# EAGLE design marshall (EAGLE 7.1.0)
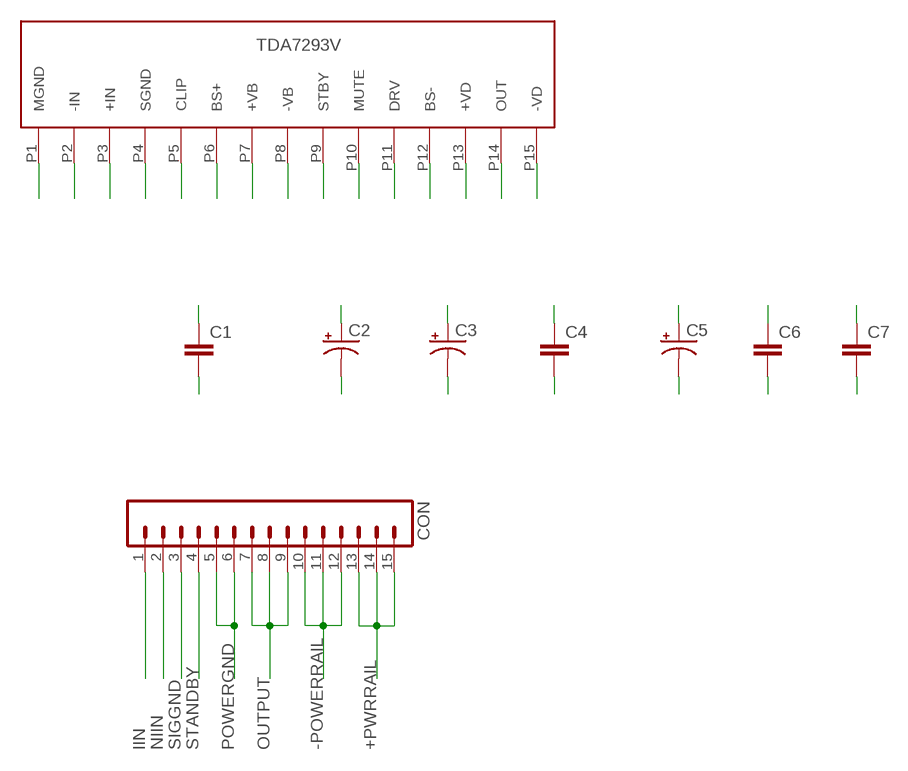
[diagram p0: schematic, sheet 1]

## Parts
C1  CAPPTH1  [CAP-PTH-5MM]
C2  CAP_POLPTH2  [CPOL-RADIAL-10UF-25V]
C3  CAP_POLPTH2  [CPOL-RADIAL-10UF-25V]
C4  CAPPTH1  [CAP-PTH-5MM]
C5  CAP_POLPTH2  [CPOL-RADIAL-10UF-25V]
C6  CAPPTH1  [CAP-PTH-5MM]
C7  CAPPTH1  [CAP-PTH-5MM]
CON  M15  [1X15]
U$1  TDA7293V  [TDA7293V]

## Nets
+PWRRAIL: C1.1 C2.1(+) CON.13 CON.14 CON.15 U$1.P7(+VB) U$1.P10(MUTE) U$1.P13(+VD)
-POWERRAIL: C3.2(-) C4.1 CON.10 CON.11 CON.12 U$1.P8(-VB) U$1.P15(-VD)
C5+: C5.1(+) U$1.P12(BS-)
C5-: C5.2(-) U$1.P6(BS+)
IIN: C6.2 C7.2 CON.1
N$17: U$1.P2(-IN)
N$20: U$1.P5(CLIP)
N$26: U$1.P11(DRV)
NIIN: C6.1 CON.2 U$1.P3(+IN)
OUTPUT: CON.7 CON.8 CON.9 U$1.P14(OUT)
POWERGND: C1.2 C2.2(-) C3.1(+) C4.2 CON.5 CON.6 U$1.P1(MGND)
SIGGND: C7.1 CON.3 U$1.P4(SGND)
STANDBY: CON.4 U$1.P9(STBY)

## Library data of the parts
C1 C4 C6 C7 = SparkFun-Capacitors:CAP: Capacitor Standard 0603 ceramic capacitor, and 0.1" leaded capacitor.
C2 C3 C5 = SparkFun-Capacitors:CAP_POL: Capacitor Polarized These are standard SMD and PTH capacitors. Normally 10uF, 47uF, and 100uF in electrolytic and tantalum varieties. Always verify the external diameter of the through hole cap, it varies with capacity, voltage, and manufacturer. The EIA devices should be standard.
CON = SparkFun-Connectors:M15: Header 15 Standard 15-pin 0.1" header. Use with straight break away headers (SKU : PRT-00116), right angle break away headers (PRT-00553), swiss pins (PRT-00743), machine pins (PRT-00117), and female headers (PRT-00115).
U$1 = TDA7293V:TDA7293V

## Board
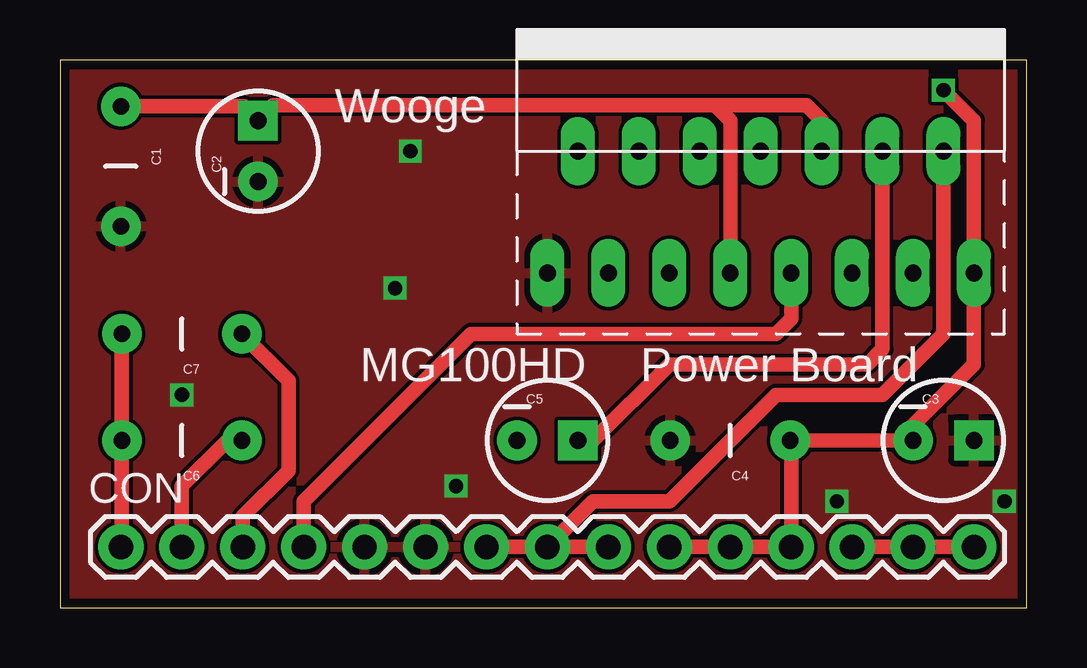
[diagram p1: board, top side]
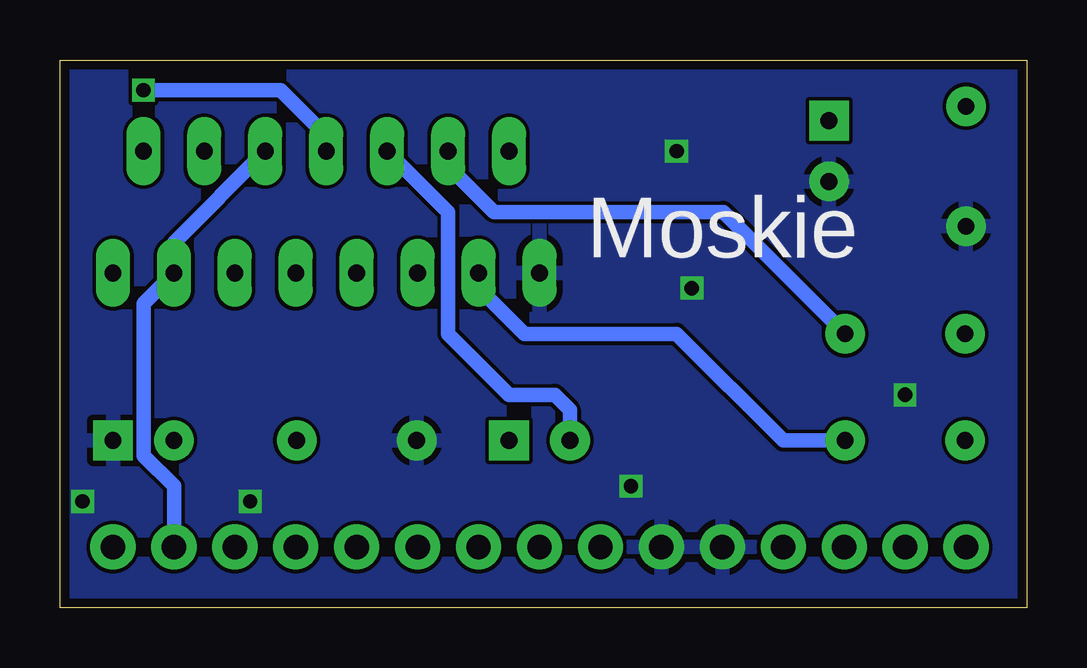
[diagram p2: board, bottom side, seen from below]

Size 40.31 x 22.85 mm. Coordinates in mm from the lower left corner, seen from the top.
Outline: 0,0 40.31,0 40.31,22.85 0,22.85 0,0
Copper layers (1*16): Top 0.0356mm / dielectric 1.5011mm / Bottom 0.0356mm
Design rules "LaenPCBOrder": minimum track width 6mil, minimum drill 13mil, track to track 6mil, track to pad 6mil, pad to pad 6mil, via to via 6mil, smd to smd 6mil, copper to edge 15mil, drill to drill 6mil, minimum pad ring 7mil, minimum via ring 7mil, stop-mask expansion 3mil, vias tented up to drill 0mil, thermal gap 10mil

### Footprints (pad centres in the part's own frame; a part is rotated, then mirrored left to right if it is on the bottom)
CAP-PTH-5MM = drill 0.7 pad 1.651: 1 -2.5,0; 2 2.5,0
CPOL-RADIAL-10UF-25V = drill 0.7 pad 1.651 square: 1 1.27,0 | drill 0.7 pad 1.651: 2 -1.27,0
1X15 = drill 1.016 pad 1.88: 1 0,0; 2 2.54,0; 3 5.08,0; 4 7.62,0; 5 10.16,0; 6 12.7,0; 7 15.24,0; 8 17.78,0; 9 20.32,0; 10 22.86,0; 11 25.4,0; 12 27.94,0; 13 30.48,0; 14 33.02,0; 15 35.56,0
TDA7293V = drill 0.7 pad 1.422 long: P1 1.27,-5.08; P2 2.54,0; P3 3.81,-5.08; P4 5.08,0; P5 6.35,-5.08; P6 7.62,0; P7 8.89,-5.08; P8 10.16,0; P9 11.43,-5.08; P10 12.7,0; P11 13.97,-5.08; P12 15.24,0; P13 16.51,-5.08; P14 17.78,0; P15 19.05,-5.08

### Placement (x,y rotation side)
C1  2.54,18.41 270 top
C2  8.26,19.05 90 top
C3  36.83,6.99 0 top
C4  27.94,6.99 180 top
C5  20.32,6.99 0 top
C6  5.08,6.99 180 top
C7  5.08,11.43 180 top
CON  2.54,2.54 0 top
U$1  19.05,19.05 0 top

### Tracks (layer width: path | path; a pad name or v marks a point on that pad's centre or on a via)
+PWRRAIL
  Top 0.61: C1.1 7.66,20.91 C2.1 8.89,20.95 27.3,20.95 | U$1.P7 27.94,20.32 27.3,20.95 | U$1.P10 31.75,20.32 31.11,20.95 27.3,20.95 | CON.13 CON.14 CON.15
  Bottom 0.61: U$1.P10 35.56,15.24 U$1.P13 36.83,12.7 36.83,6.35 35.56,5.08 CON.14
-POWERRAIL  (via drill 0.6)
  Top 0.61: C3.2 35.56,7.62 | 35.56,7.62 38.1,10.16 U$1.P15 38.1,20.32 v36.83,21.59 | 35.56,7.62 34.92,6.99 C4.1 30.48,6.95 CON.12 CON.11 CON.10
  Bottom 0.61: v36.83,21.59 31.11,21.59 29.21,19.68 U$1.P8
C5+
  Top 0.61: C5.1 22.23,6.99 25.4,10.16 33.66,10.16 34.29,10.79 U$1.P12
C5-
  Bottom 0.61: U$1.P6 24.13,16.51 24.13,11.43 21.59,8.89 19.68,8.89 19.05,8.26 C5.2
IIN
  Top 0.61: C7.2 C6.2 2.58,2.58 CON.1
NIIN
  Top 0.61: C6.1 6.99,6.99 5.08,5.08 CON.2
  Bottom 0.61: U$1.P3 22.86,13.34 20.95,11.43 14.61,11.43 10.16,6.99 C6.1
OUTPUT
  Top 0.61: U$1.P14 36.83,11.43 34.29,8.89 29.84,8.89 25.4,4.45 22.23,4.45 CON.8 | CON.7 CON.8 | CON.9 CON.8
POWERGND  (via drill 0.6)
  other vias: 14.61,19.05 13.97,13.34 5.08,8.89 16.51,5.08 32.38,4.45 39.37,4.45
  pour Top: 0,30.48 0,0 40.64,0 40.64,30.48
  pour Bottom: -2.54,22.86 -2.54,-2.54 43.18,-2.54 43.18,25.4 -2.54,25.4
SIGGND
  Top 0.61: CON.3 7.62,3.81 9.53,5.71 9.53,9.48 C7.1
  Bottom 0.61: U$1.P4 24.13,18.41 22.23,16.51 12.66,16.51 C7.1
STANDBY
  Top 0.61: U$1.P9 30.48,12.06 29.84,11.43 17.14,11.43 10.16,4.45 CON.4

### Text on the board
tPlace: Wooge | MG100HD Power Board
bPlace: Moskie